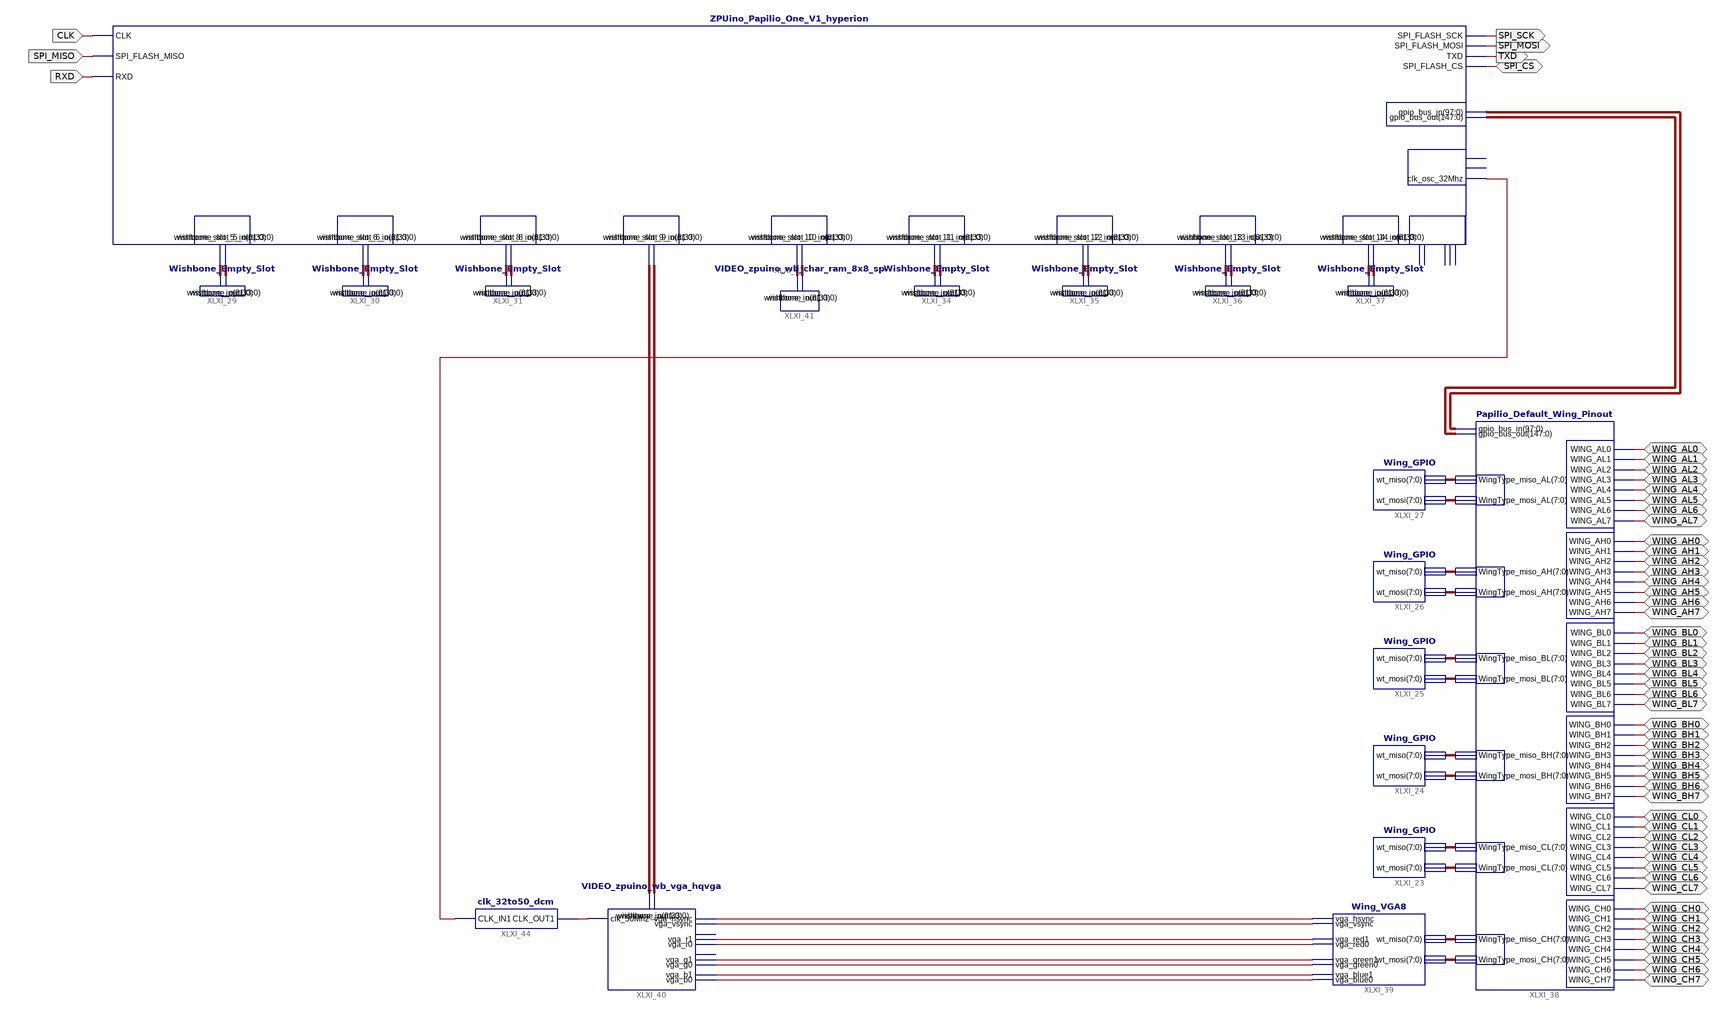
[diagram p0: schematic sheet 1]
// Xilinx ISE schematic Papilio_SOC_Base_Papilio_One.sch (spartan3e) as structural Verilog: 18 symbols, 55 ports
module Papilio_SOC_Base_Papilio_One (
  input  RXD,
  input  SPI_MISO,
  input  CLK,
  inout  WING_AL0,
  inout  WING_AL1,
  inout  WING_AL2,
  inout  WING_AL3,
  inout  WING_AL4,
  inout  WING_AL5,
  inout  WING_AL6,
  inout  WING_AL7,
  inout  WING_AH0,
  inout  WING_AH1,
  inout  WING_AH2,
  inout  WING_AH3,
  inout  WING_AH4,
  inout  WING_AH5,
  inout  WING_AH6,
  inout  WING_AH7,
  inout  WING_BL0,
  inout  WING_BL1,
  inout  WING_BL2,
  inout  WING_BL3,
  inout  WING_BL4,
  inout  WING_BL5,
  inout  WING_BL6,
  inout  WING_BL7,
  inout  WING_BH0,
  inout  WING_BH1,
  inout  WING_BH2,
  inout  WING_BH3,
  inout  WING_BH4,
  inout  WING_BH5,
  inout  WING_BH6,
  inout  WING_BH7,
  inout  WING_CL0,
  inout  WING_CL1,
  inout  WING_CL2,
  inout  WING_CL3,
  inout  WING_CL4,
  inout  WING_CL5,
  inout  WING_CL6,
  inout  WING_CL7,
  inout  WING_CH0,
  inout  WING_CH1,
  inout  WING_CH2,
  inout  WING_CH3,
  inout  WING_CH4,
  inout  WING_CH5,
  inout  WING_CH6,
  inout  WING_CH7,
  inout  SPI_CS,
  output TXD,
  output SPI_MOSI,
  output SPI_SCK
);

  wire XLXN_450, XLXN_451, XLXN_452, XLXN_453, XLXN_454, XLXN_455, XLXN_456, XLXN_457, XLXN_462, XLXN_463;
  wire [7:0] XLXN_327, XLXN_328, XLXN_329, XLXN_330, XLXN_331, XLXN_332, XLXN_333, XLXN_334, XLXN_335,
       XLXN_336, XLXN_448, XLXN_449;
  wire [33:0] XLXN_431, XLXN_433, XLXN_435, XLXN_437, XLXN_443, XLXN_445, XLXN_447, XLXN_459, XLXN_461;
  wire [61:0] XLXN_430, XLXN_432, XLXN_434, XLXN_436, XLXN_442, XLXN_444, XLXN_446, XLXN_458, XLXN_460;
  wire [97:0] XLXN_409;
  wire [147:0] XLXN_408;

  Wishbone_Empty_Slot XLXI_37 (.wishbone_in(XLXN_430), .wishbone_out(XLXN_431));
  Wishbone_Empty_Slot XLXI_36 (.wishbone_in(XLXN_432), .wishbone_out(XLXN_433));
  Wishbone_Empty_Slot XLXI_35 (.wishbone_in(XLXN_434), .wishbone_out(XLXN_435));
  Wishbone_Empty_Slot XLXI_34 (.wishbone_in(XLXN_436), .wishbone_out(XLXN_437));
  Wishbone_Empty_Slot XLXI_31 (.wishbone_in(XLXN_442), .wishbone_out(XLXN_443));
  Wishbone_Empty_Slot XLXI_30 (.wishbone_in(XLXN_444), .wishbone_out(XLXN_445));
  Wishbone_Empty_Slot XLXI_29 (.wishbone_in(XLXN_446), .wishbone_out(XLXN_447));
  Wing_GPIO XLXI_27 (.wt_miso(XLXN_335), .wt_mosi(XLXN_336));
  Wing_GPIO XLXI_26 (.wt_miso(XLXN_333), .wt_mosi(XLXN_334));
  Wing_GPIO XLXI_25 (.wt_miso(XLXN_331), .wt_mosi(XLXN_332));
  Wing_GPIO XLXI_24 (.wt_miso(XLXN_329), .wt_mosi(XLXN_330));
  Wing_GPIO XLXI_23 (.wt_miso(XLXN_327), .wt_mosi(XLXN_328));
  Papilio_Default_Wing_Pinout XLXI_38 (
    .WING_AH0(WING_AH0), .WING_AH1(WING_AH1), .WING_AH2(WING_AH2), .WING_AH3(WING_AH3), .WING_AH4(WING_AH4),
    .WING_AH5(WING_AH5), .WING_AH6(WING_AH6), .WING_AH7(WING_AH7), .WING_AL0(WING_AL0), .WING_AL1(WING_AL1),
    .WING_AL2(WING_AL2), .WING_AL3(WING_AL3), .WING_AL4(WING_AL4), .WING_AL5(WING_AL5), .WING_AL6(WING_AL6),
    .WING_AL7(WING_AL7), .WING_BH0(WING_BH0), .WING_BH1(WING_BH1), .WING_BH2(WING_BH2), .WING_BH3(WING_BH3),
    .WING_BH4(WING_BH4), .WING_BH5(WING_BH5), .WING_BH6(WING_BH6), .WING_BH7(WING_BH7), .WING_BL0(WING_BL0),
    .WING_BL1(WING_BL1), .WING_BL2(WING_BL2), .WING_BL3(WING_BL3), .WING_BL4(WING_BL4), .WING_BL5(WING_BL5),
    .WING_BL6(WING_BL6), .WING_BL7(WING_BL7), .WING_CL0(WING_CL0), .WING_CL1(WING_CL1), .WING_CL2(WING_CL2),
    .WING_CL3(WING_CL3), .WING_CL4(WING_CL4), .WING_CL5(WING_CL5), .WING_CL6(WING_CL6), .WING_CL7(WING_CL7),
    .WING_CH0(WING_CH0), .WING_CH1(WING_CH1), .WING_CH2(WING_CH2), .WING_CH3(WING_CH3), .WING_CH4(WING_CH4),
    .WING_CH5(WING_CH5), .WING_CH6(WING_CH6), .WING_CH7(WING_CH7), .gpio_bus_out(XLXN_408),
    .gpio_bus_in(XLXN_409), .WingType_miso_BH(XLXN_329), .WingType_miso_BL(XLXN_331),
    .WingType_miso_AH(XLXN_333), .WingType_mosi_BL(XLXN_332), .WingType_mosi_BH(XLXN_330),
    .WingType_mosi_CL(XLXN_328), .WingType_mosi_AH(XLXN_334), .WingType_miso_CL(XLXN_327),
    .WingType_miso_CH(XLXN_448), .WingType_mosi_CH(XLXN_449), .WingType_mosi_AL(XLXN_336),
    .WingType_miso_AL(XLXN_335));
  Wing_VGA8 XLXI_39 (
    .vga_hsync(XLXN_450), .vga_vsync(XLXN_451), .vga_red1(XLXN_452), .vga_red0(XLXN_453),
    .vga_green1(XLXN_454), .vga_green0(XLXN_455), .wt_miso(XLXN_448), .wt_mosi(XLXN_449),
    .vga_blue1(XLXN_456), .vga_blue0(XLXN_457));
  VIDEO_zpuino_wb_vga_hqvga XLXI_40 (
    .clk_50Mhz(XLXN_462), .vga_hsync(XLXN_450), .vga_vsync(XLXN_451), .vga_r1(XLXN_452), .vga_r0(XLXN_453),
    .vga_g1(XLXN_454), .vga_g0(XLXN_455), .vga_b1(XLXN_456), .vga_b0(XLXN_457), .wishbone_in(XLXN_458),
    .wishbone_out(XLXN_459));  // open: vga_r2, vga_g2
  VIDEO_zpuino_wb_char_ram_8x8_sp XLXI_41 (.wishbone_in(XLXN_460), .wishbone_out(XLXN_461));
  ZPUino_Papilio_One_V1_hyperion XLXI_43 (
    .clk_osc_32Mhz(XLXN_463), .wishbone_slot_14_in(XLXN_430), .wishbone_slot_14_out(XLXN_431),
    .wishbone_slot_13_in(XLXN_432), .wishbone_slot_13_out(XLXN_433), .wishbone_slot_12_in(XLXN_434),
    .wishbone_slot_12_out(XLXN_435), .wishbone_slot_11_in(XLXN_436), .wishbone_slot_11_out(XLXN_437),
    .wishbone_slot_10_in(XLXN_460), .wishbone_slot_10_out(XLXN_461), .wishbone_slot_9_in(XLXN_458),
    .wishbone_slot_9_out(XLXN_459), .wishbone_slot_8_in(XLXN_442), .wishbone_slot_8_out(XLXN_443),
    .wishbone_slot_6_in(XLXN_444), .wishbone_slot_6_out(XLXN_445), .wishbone_slot_5_out(XLXN_447),
    .wishbone_slot_5_in(XLXN_446), .CLK(CLK), .SPI_FLASH_MISO(SPI_MISO), .RXD(RXD), .SPI_FLASH_SCK(SPI_SCK),
    .SPI_FLASH_MOSI(SPI_MOSI), .TXD(TXD), .SPI_FLASH_CS(SPI_CS), .gpio_bus_out(XLXN_408),
    .gpio_bus_in(XLXN_409));  // open: clk_96Mhz, clk_1Mhz, wishbone_slot_video_in, wishbone_slot_video_out, vgaclkout, wishbone_slot_15_in, wishbone_slot_15_out
  clk_32to50_dcm XLXI_44 (.CLK_IN1(XLXN_463), .CLK_OUT1(XLXN_462));
endmodule
